# EAGLE design Power Strip (EAGLE 9.2.0)
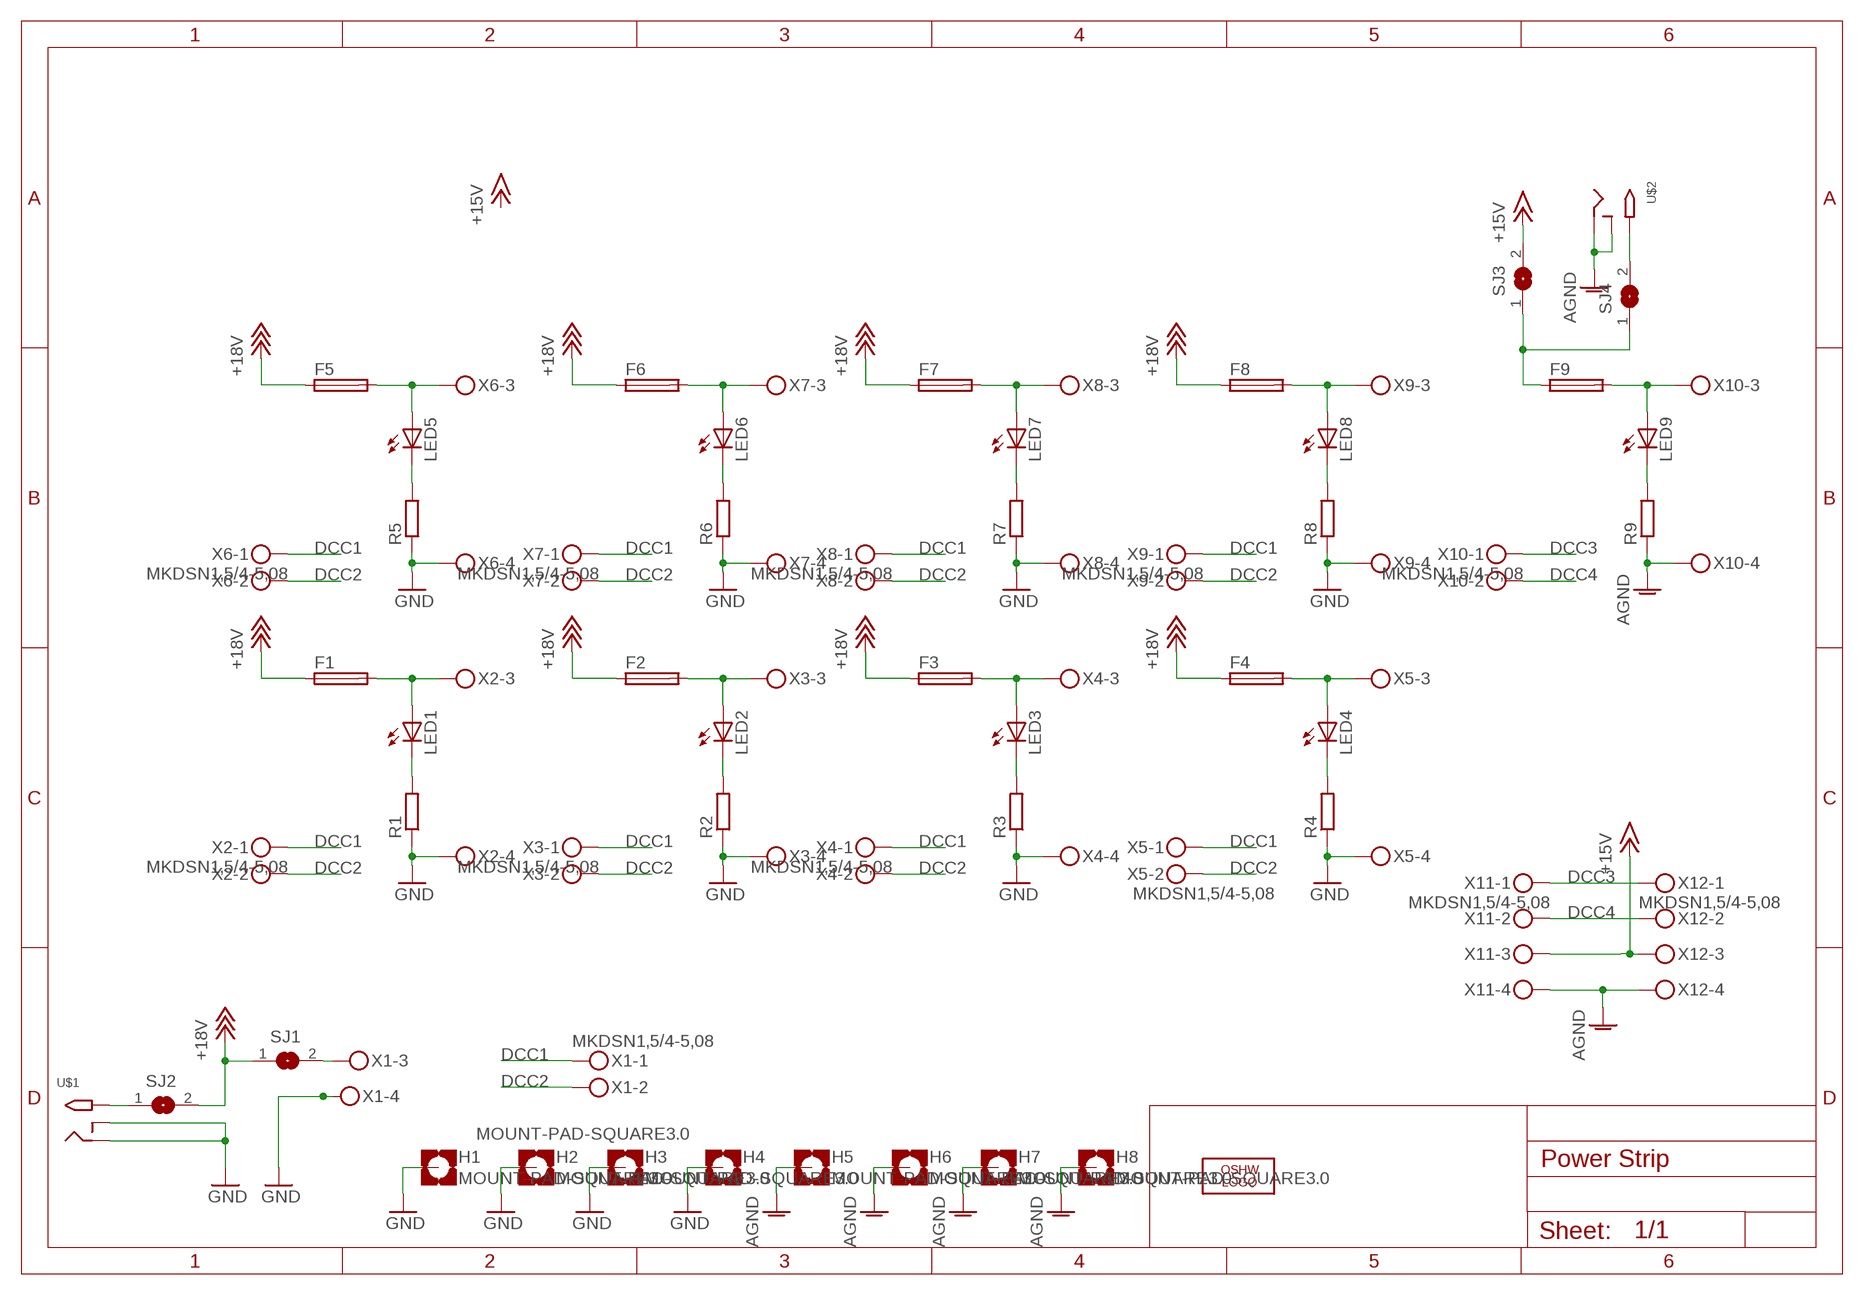
[diagram p0: schematic, sheet 1]

## Parts
F1  TE5  [TE5]
F2  TE5  [TE5]
F3  TE5  [TE5]
F4  TE5  [TE5]
F5  TE5  [TE5]
F6  TE5  [TE5]
F7  TE5  [TE5]
F8  TE5  [TE5]
F9  TE5  [TE5]
H1  MOUNT-PAD-SQUARE3.0  [3,0-PAD-SQUARE]
H2  MOUNT-PAD-SQUARE3.0  [3,0-PAD-SQUARE]
H3  MOUNT-PAD-SQUARE3.0  [3,0-PAD-SQUARE]
H4  MOUNT-PAD-SQUARE3.0  [3,0-PAD-SQUARE]
H5  MOUNT-PAD-SQUARE3.0  [3,0-PAD-SQUARE]
H6  MOUNT-PAD-SQUARE3.0  [3,0-PAD-SQUARE]
H7  MOUNT-PAD-SQUARE3.0  [3,0-PAD-SQUARE]
H8  MOUNT-PAD-SQUARE3.0  [3,0-PAD-SQUARE]
LED1  LED3MM  [LED3MM]
LED2  LED3MM  [LED3MM]
LED3  LED3MM  [LED3MM]
LED4  LED3MM  [LED3MM]
LED5  LED3MM  [LED3MM]
LED6  LED3MM  [LED3MM]
LED7  LED3MM  [LED3MM]
LED8  LED3MM  [LED3MM]
LED9  LED3MM  [LED3MM]
LOGO1  OSHW_LOGO_6MILX0200-NT  [OSHW_6X200_NOTEXT]
R1  R-EU_R0805  [R0805]
R2  R-EU_R0805  [R0805]
R3  R-EU_R0805  [R0805]
R4  R-EU_R0805  [R0805]
R5  R-EU_R0805  [R0805]
R6  R-EU_R0805  [R0805]
R7  R-EU_R0805  [R0805]
R8  R-EU_R0805  [R0805]
R9  R-EU_R0805  [R0805]
SJ1  SJ  [SJ]
SJ2  SJ  [SJ]
SJ3  SJ  [SJ]
SJ4  SJ  [SJ]
U$1  2.1MMJACKTHM  [PJ-102A]
U$2  2.1MMJACKTHM  [PJ-102A]
X1  MKDSN1,5/4-5,08  [MKDSN1,5/4-5,08]
X2  MKDSN1,5/4-5,08  [MKDSN1,5/4-5,08]
X3  MKDSN1,5/4-5,08  [MKDSN1,5/4-5,08]
X4  MKDSN1,5/4-5,08  [MKDSN1,5/4-5,08]
X5  MKDSN1,5/4-5,08  [MKDSN1,5/4-5,08]
X6  MKDSN1,5/4-5,08  [MKDSN1,5/4-5,08]
X7  MKDSN1,5/4-5,08  [MKDSN1,5/4-5,08]
X8  MKDSN1,5/4-5,08  [MKDSN1,5/4-5,08]
X9  MKDSN1,5/4-5,08  [MKDSN1,5/4-5,08]
X10  MKDSN1,5/4-5,08  [MKDSN1,5/4-5,08]
X11  MKDSN1,5/4-5,08  [MKDSN1,5/4-5,08]
X12  MKDSN1,5/4-5,08  [MKDSN1,5/4-5,08]

## Nets
+15V: SJ3.2 X11.3 X12.3
+18V: F1.1 F2.1 F3.1 F4.1 F5.1 F6.1 F7.1 F8.1 SJ1.1 SJ2.2
AGND: H5.B3,0(MOUNT) H6.B3,0(MOUNT) H7.B3,0(MOUNT) H8.B3,0(MOUNT) R9.1 U$2.RING U$2.RING_SW X10.4 X11.4 X12.4
DCC1: X1.1 X2.1 X3.1 X4.1 X5.1 X6.1 X7.1 X8.1 X9.1
DCC2: X1.2 X2.2 X3.2 X4.2 X5.2 X6.2 X7.2 X8.2 X9.2
DCC3: X10.1 X11.1 X12.1
DCC4: X10.2 X11.2 X12.2
GND: H1.B3,0(MOUNT) H2.B3,0(MOUNT) H3.B3,0(MOUNT) H4.B3,0(MOUNT) R1.1 R2.1 R3.1 R4.1 R5.1 R6.1 R7.1 R8.1 U$1.RING U$1.RING_SW X1.4 X2.4 X3.4 X4.4 X5.4 X6.4 X7.4 X8.4 X9.4
N$1: LED1.K(C) R1.2
N$2: F1.2 LED1.A X2.3
N$3: LED2.K(C) R2.2
N$4: F2.2 LED2.A X3.3
N$5: LED3.K(C) R3.2
N$6: F3.2 LED3.A X4.3
N$7: LED4.K(C) R4.2
N$8: F4.2 LED4.A X5.3
N$9: LED5.K(C) R5.2
N$10: F5.2 LED5.A X6.3
N$11: LED6.K(C) R6.2
N$12: F6.2 LED6.A X7.3
N$13: LED7.K(C) R7.2
N$14: F7.2 LED7.A X8.3
N$15: LED8.K(C) R8.2
N$16: F8.2 LED8.A X9.3
N$17: SJ1.2 X1.3
N$18: SJ2.1 U$1.TIP
N$19: LED9.K(C) R9.2
N$20: F9.2 LED9.A X10.3
N$21: F9.1 SJ3.1 SJ4.1
N$22: SJ4.2 U$2.TIP

## Library data of the parts
F1-F9 = fuse:TE5: FUSE Wickmann; OC_FARNELL: unknown; OC_NEWARK: unknown
H1-H8 = holes:MOUNT-PAD-SQUARE: MOUNTING PAD, square
LED1-LED9 = led:LED: LED OSRAM: - CHIPLED LG R971, LG N971, LY N971, LG Q971, LY Q971, LO R971, LY R971 LH N974, LH R974 LS Q976, LO Q976, LY Q976 LO Q996 - Hyper CHIPLED LW Q18S LB Q993, LB Q99A, LB R99A - SideLED LS A670, LO A670, LY A670, LG A670, LP A670 LB A673, LV A673, LT A673, LW A673 LH A674 LY A675 LS A676, LA A676, LO A676, LY A676, LW A676 LS A679, LY A679, LG A679 - Hyper Micro SIDELED® LS Y876, LA Y876, LO Y876, LY Y876 LT Y87S - SmartLED LW L88C, LW L88S LB L89C, LB L89S, LG L890 LS L89K, LO L89K, LY L89K LS L896, LA L896, LO L896, LY L896 - TOPLED LS T670, LO T670, LY T670, LG T670, LP T670 LSG T670, LSP T670, LSY T670, LOP T670, LYG T670 LG T671, LOG T671, LSG T671 LB T673, LV T673, LT T673, LW T673 LH T674 LS T676, LA T676, LO T676, LY T676, LB T676, LH T676, LSB T676, LW T676 LB T67C, LV T67C, LT T67C, LS T67K, LO T67K, LY T67K, LW E67C LS E67B, LA E67B, LO E67B, LY E67B, LB E67C, LV E67C, LT E67C LW T67C LS T679, LY T679, LG T679 LS T770, LO T770, LY T770, LG T770, LP T770 LB T773, LV T773, LT T773, LW T773 LH T774 LS E675, LA E675, LY E675, LS T675 LS T776, LA T776, LO T776, LY T776, LB T776 LHGB T686 LT T68C, LB T68C - Hyper Mini TOPLED® LB M676 - Mini TOPLED Santana® LG M470 LS M47K, LO M47K, LY M47K Source: http://www.osram.convergy.de LUXEON: - LUMILED® LXK2-PW12-R00, LXK2-PW12-S00, LXK2-PW14-U00, LXK2-PW14-V00 LXK2-PM12-R00, LXK2-PM12-S00, LXK2-PM14-U00 LXK2-PE12-Q00, LXK2-PE12-R00, LXK2-PE12-S00, LXK2-PE14-T00, LXK2-PE14-U00 LXK2-PB12-K00, LXK2-PB12-L00, LXK2-PB12-M00, LXK2-PB14-N00, LXK2-PB14-P00, LXK2-PB14-Q00 LXK2-PR12-L00, LXK2-PR12-M00, LXK2-PR14-Q00, LXK2-PR14-R00 LXK2-PD12-Q00, LXK2-PD12-R00, LXK2-PD12-S00 LXK2-PH12-R00, LXK2-PH12-S00 LXK2-PL12-P00, LXK2-PL12-Q00, LXK2-PL12-R00 Source: www.luxeon.com KINGBRIGHT: KA-3528ASYC Source: www.kingbright.com
LOGO1 = ohw-logo:OSHW_LOGO_6MIL
R1-R9 = rcl:R-EU_: RESISTOR, European symbol
SJ1-SJ4 = jumper:SJ: SMD solder JUMPER
U$1 U$2 = adafruit:2.1MMJACK: 2.1mm x 5.5mm THM DC jack with internal switch. Digikey part #PJ-102A, 4UCON part #05537 2.1mm x 5.5mm SMT DC jack with internal switch. Digikey part #PJ-002A-SMT, 4UCON part #03267 By microbuilder.eu & adafruit.com
X1-X12 = con-phoenix-508:MKDSN1,5/4-5,08: MKDSN 1,5/ 4-5,08 Printklemme Nennstrom: 13,5 A Nennspannung: 250 V Rastermaß: 5,08 mm Polzahl: 4 Anschlussart: Schraubanschluss Montage: Löten Anschlussrichtung Leiter/Platine: 0 ° Artikelnummer: 1729144 Source: http://eshop.phoenixcontact.com .. 1729144.pdf

## Board
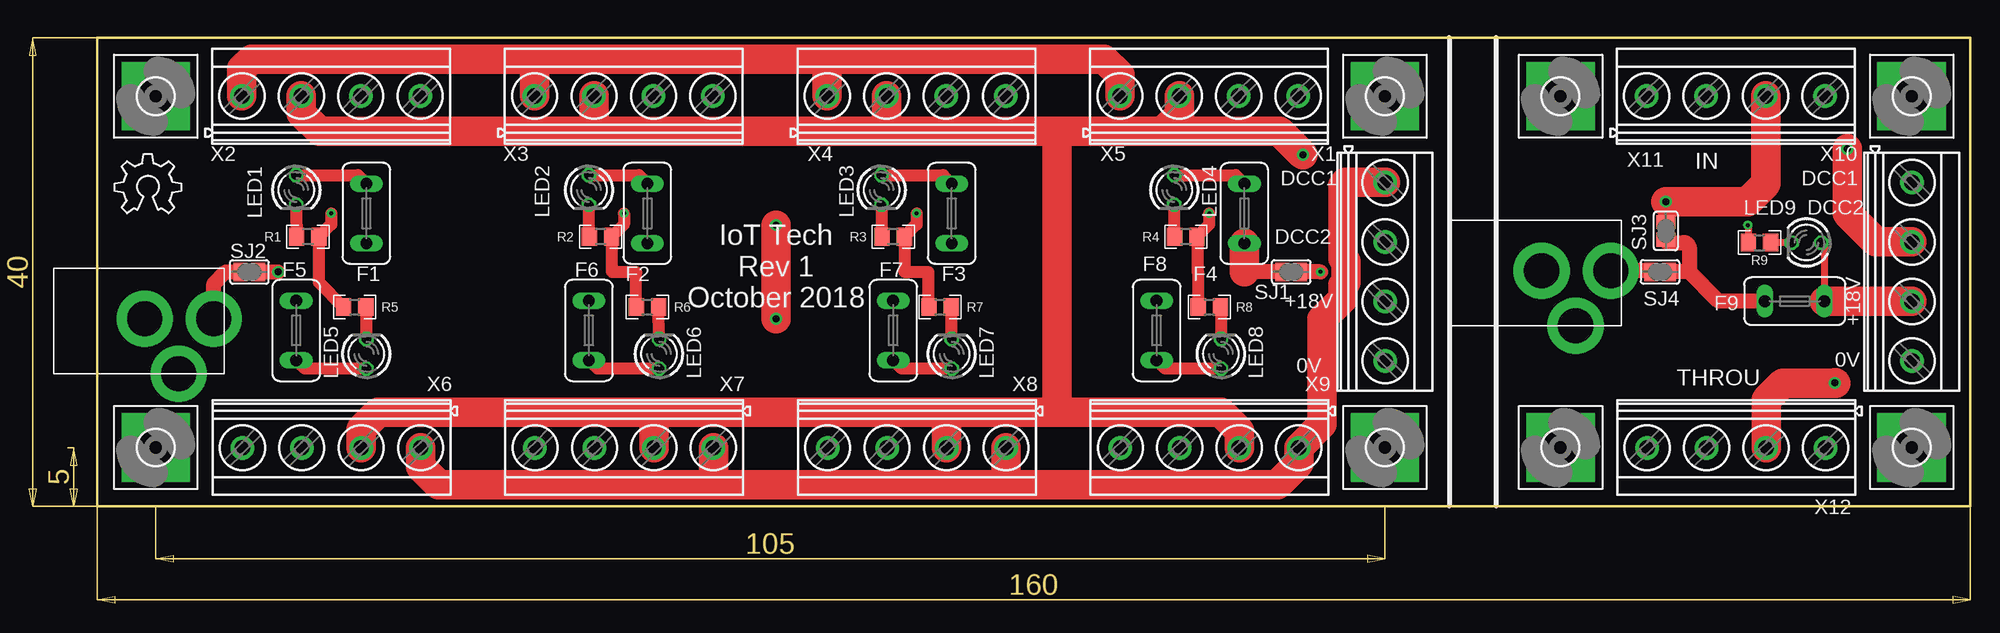
[diagram p1: board, top side]
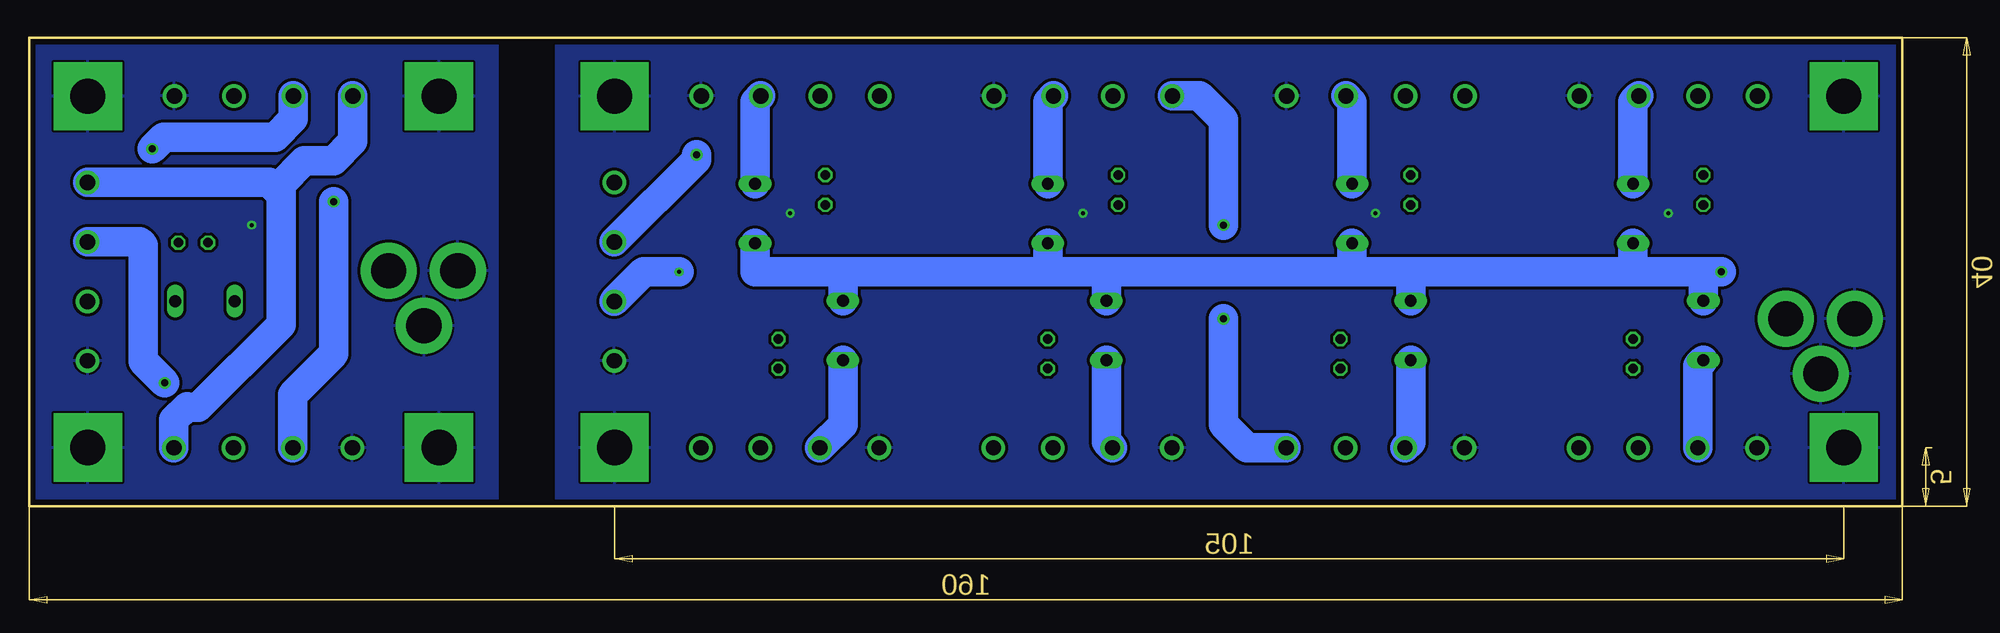
[diagram p2: board, bottom side, seen from below]

Size 160 x 40 mm. Coordinates in mm from the lower left corner, seen from the top.
Outline: 0,0 160,0 160,40 0,40 0,0
Copper layers (1*16): Top 0.07mm / dielectric 1.55mm / Bottom 0.07mm
Design rules "eC-STANDARD_pool-2-layer-70Ê-base-copper": minimum track width 0.2mm, minimum drill 0.25mm, track to track 0.25mm, track to pad 0.25mm, pad to pad 0.25mm, via to via 0.25mm, smd to smd 0.25mm, copper to edge 0.45mm, drill to drill 0.3mm, minimum pad ring 0.2mm, minimum via ring 0.2mm, stop-mask expansion 0.1mm, vias tented up to drill 0mil, thermal gap 0.2mm

### Footprints (pad centres in the part's own frame; a part is rotated, then mirrored left to right if it is on the bottom)
TE5 = drill 1.016 long: 1 -2.54,0; 2 2.54,0
3,0-PAD-SQUARE = drill 3 pad 5.842 square: B3,0 0,0
LED3MM = drill 0.813 octagon: A -1.27,0; K 1.27,0
R0805 = smd 1.3 x 1.5: 1 -0.95,0; 2 0.95,0
SJ = smd 1.168 x 1.6: 1 -0.762,0; 2 0.762,0
PJ-102A = drill 3 pad 4.8: RING 0.1,-3.39; RING_SW -4.6,-6.29; TIP 0.1,-9.29
MKDSN1,5/4-5,08 = drill 1.3 pad 2: 1 -7.641,0.025; 2 -2.561,0.025; 3 2.519,0.025; 4 7.599,0.025

### Placement (x,y rotation side)
F1  23,25 90 top
F2  47,25 90 top
F3  73,25 90 top
F4  98,25 90 top
F5  17,15 270 top
F6  42,15 270 top
F7  68,15 270 top
F8  90.5,15 270 top
F9  145,17.5 0 top
H1  5,5 0 top
H2  5,35 0 top
H3  110,35 0 top
H4  110,5 0 top
H5  125,35 0 top
H6  125,5 0 top
H7  155,35 0 top
H8  155,5 0 top
LED1  17,27 270 top
LED2  42,27 270 top
LED3  67,27 270 top
LED4  92,27 270 top
LED5  23,13 90 top
LED6  48,13 90 top
LED7  73,13 90 top
LED8  96,13 90 top
LED9  146,22.5 180 top
LOGO1  1.5,25 0 top
R1  18,23 180 top
R2  43,23 180 top
R3  68,23 180 top
R4  93,23 180 top
R5  22,17 0 top
R6  47,17 0 top
R7  72,17 0 top
R8  95,17 0 top
R9  142,22.5 0 top
SJ1  102,20 0 top
SJ2  13,20 0 top
SJ3  134,23.5 90 top
SJ4  133.5,20 180 top
U$1  0.67,15.91 90 top
U$2  120,20 90 top
X1  110,20 270 top
X2  20,35 0 top
X3  45,35 0 top
X4  70,35 0 top
X5  95,35 0 top
X6  20,5 180 top
X7  45,5 180 top
X8  70,5 180 top
X9  95,5 180 top
X10  155,20 270 top
X11  140,35 0 top
X12  140,5 180 top

### Tracks (layer width: path | path; a pad name or v marks a point on that pad's centre or on a via)
+15V  (via drill 0.6)
  Top 1.27: SJ3.2 v134,26
  Top 2.54: v134,26 141,26 142.52,27.52 X11.3
  Bottom 2.54: X12.3 137.48,9.52 134,13 v134,26
+18V  (via drill 0.6)
  Top 1.27: SJ2.2 v15.46,20 | SJ1.1 98,20
  Top 2.54: 98,20 F4.1
  Bottom 2.54: 90.5,20 98,20 F4.1 | 90.5,20 73,20 | 73,20 68,20 | 68,20 47,20 | 47,20 42,20 | 42,20 23,20 | 23,20 17,20 | 17,20 F5.1 | F2.1 47,20 | 42,20 F6.1 | F3.1 73,20 | F7.1 68,20 | 90.5,20 F8.1 | F1.1 23,20 | 17,20 v15.46,20
AGND  (via drill 0.35)
  Top 0.61: v141,24 141.05,23.95 R9.1
  pour Bottom: 120,0 160,0 160,40 120,40
DCC1  (via drill 0.6)
  Top 2.54: X6.1 27.64,3.36 29.18,1.82 52,1.82 | 52,1.82 77,1.82 | 77,1.82 100.82,1.82 102.64,3.64 X9.1 104.64,6.97 104.64,15.96 106.39,17.71 106.39,18.85 106.66,19.11 106.66,20.89 106.39,21.15 106.39,27.39 106.64,27.64 X1.1 | X7.1 52.64,2.46 52,1.82 | X8.1 77.64,2.46 77,1.82 | X2.1 12.36,37.36 13.18,38.18 38,38.18 | 38,38.18 62,38.18 | 62,38.18 86,38.18 87.36,36.82 X5.1 | X4.1 62.36,37.82 62,38.18 | X3.1 37.36,37.54 38,38.18 | v58,16 v58,24
  Bottom 2.54: v58,16 58,7 55.98,4.97 X7.1 | v58,24 58,33 60.02,35.02 X4.1
DCC2  (via drill 0.6)
  Top 2.54: X6.2 22.56,6.56 24,8 48,8 | X9.2 97.56,6.44 96,8 82,8 | 48,8 72,8 | 72,8 82,8 | X8.2 72.56,7.44 72,8 | X7.2 47.56,7.56 48,8 | X2.2 17.44,33.56 19,32 43,32 | 43,32 68,32 | 68,32 82,32 | 82,32 91,32 | 91,32 92.44,33.44 X5.2 | X4.2 67.44,32.56 68,32 | X3.2 42.44,32.56 43,32 | v103,30 101,32 91,32 | 82,8 82,32
  Bottom 2.54: X1.2 103,29.59 v103,30
DCC3
  Bottom 2.54: X10.1 139.5,27.64 138.5,26.64 | 138.5,26.64 138.5,15.5 145.56,8.44 146.44,8.44 146.5,8.5 147.64,7.36 X12.1 | X11.1 132.36,31.14 134,29.5 136.5,29.5 138.5,27.5 138.5,26.64
DCC4  (via drill 0.6)
  Top 2.54: X10.2 151.94,22.56 149.5,25 v149.5,30.5 | X12.2 142.56,9.06 144,10.5 148.5,10.5 148.48,10.52 v148.42,10.52
  Bottom 2.54: X10.2 150.56,22.56 150.27,22.27 150.27,12.37 v148.42,10.52 | v149.5,30.5 148.5,31.5 139,31.5 137.44,33.06 X11.2
GND  (via drill 0.35)
  Top 1.016: R5.1 18.95,19.1 R1.1 20,24.05 v20,25 | R8.1 94.05,20 94,20 94,22.95 R4.1 95,24.05 v95,25 | R7.1 71,17.05 71,20 69,20 68.95,20.05 R3.1 70,24.05 v70,25 | R6.1 46.05,19.95 46,20 44,20 43.95,20.05 R2.1 45,24.05 v45,25
  pour Bottom: 0,40 115,40 115,0 0,0
N$1
  Top 1.016: LED1.K 17,24 17.05,23.95 R1.2
N$2
  Top 1.016: F1.2 22.27,28.27 LED1.A
  Bottom 2.54: F1.2 23,34.54 X2.3
N$3
  Top 1.016: LED2.K 42,23.05 R2.2
N$4
  Top 1.016: F2.2 46.27,28.27 LED2.A
  Bottom 2.54: F2.2 47,34.51 X3.3
N$5
  Top 1.016: LED3.K 67,23.05 R3.2
N$6
  Top 1.016: F3.2 72.27,28.27 LED3.A
  Bottom 2.54: F3.2 73,34.54 X4.3
N$7
  Top 1.016: LED4.K 92,23.05 R4.2
N$8
  Top 1.016: F4.2 97.27,28.27 LED4.A
  Bottom 2.54: F4.2 98,34.54 X5.3
N$9
  Top 1.016: LED5.K 23,16.95 R5.2
N$10
  Top 1.016: LED5.A 17.73,11.73 F5.2
  Bottom 2.54: F5.2 17.48,11.98 X6.3
N$11
  Top 1.016: LED6.K R6.2
N$12
  Top 1.016: LED6.A 42.73,11.73 F6.2
  Bottom 2.54: F6.2 42,5.46 X7.3
N$13
  Top 1.016: LED7.K 73,16.95 R7.2
N$14
  Top 1.016: LED7.A 68.73,11.73 F7.2
  Bottom 2.54: F7.2 68,5.49 X8.3
N$15
  Top 1.016: R8.2 96,16.95 LED8.K
N$16
  Top 1.016: LED8.A 91.23,11.73 F8.2
  Bottom 2.54: F8.2 90.5,6.96 X9.3
N$17  (via drill 0.35)
  Top 1.27: 103.25,20 SJ1.2 v104.5,20
  Bottom 2.54: X1.3 107.51,20 v104.5,20
N$18
  Top 1.27: U$1.TIP 9.96,18.96 11,20 SJ2.1
N$19
  Top 0.61: LED9.K R9.2
N$20
  Top 0.61: LED9.A 147.54,22.23 F9.2
  Top 2.54: F9.2 147.52,17.48 X10.3
N$21
  Top 1.27: F9.1 138.5,17.5 136,20 | 136,20 SJ4.1 | SJ3.1 arc90 134.24,22.5 135.5,22.5 arc-90 136,22 136,20
N$22
  Top 1.27: SJ4.2 arc90 132.64,20.1 U$2.TIP

### Text on the board
tPlace: IN | DCC1 | DCC1 | DCC2 | DCC2 | IoT Tech / Rev 1 / October 2018 | +18V | +18V | 0V | 0V | THROU